# EAGLE board milliLearn-ice40-pcbng (EAGLE 9.5.1)
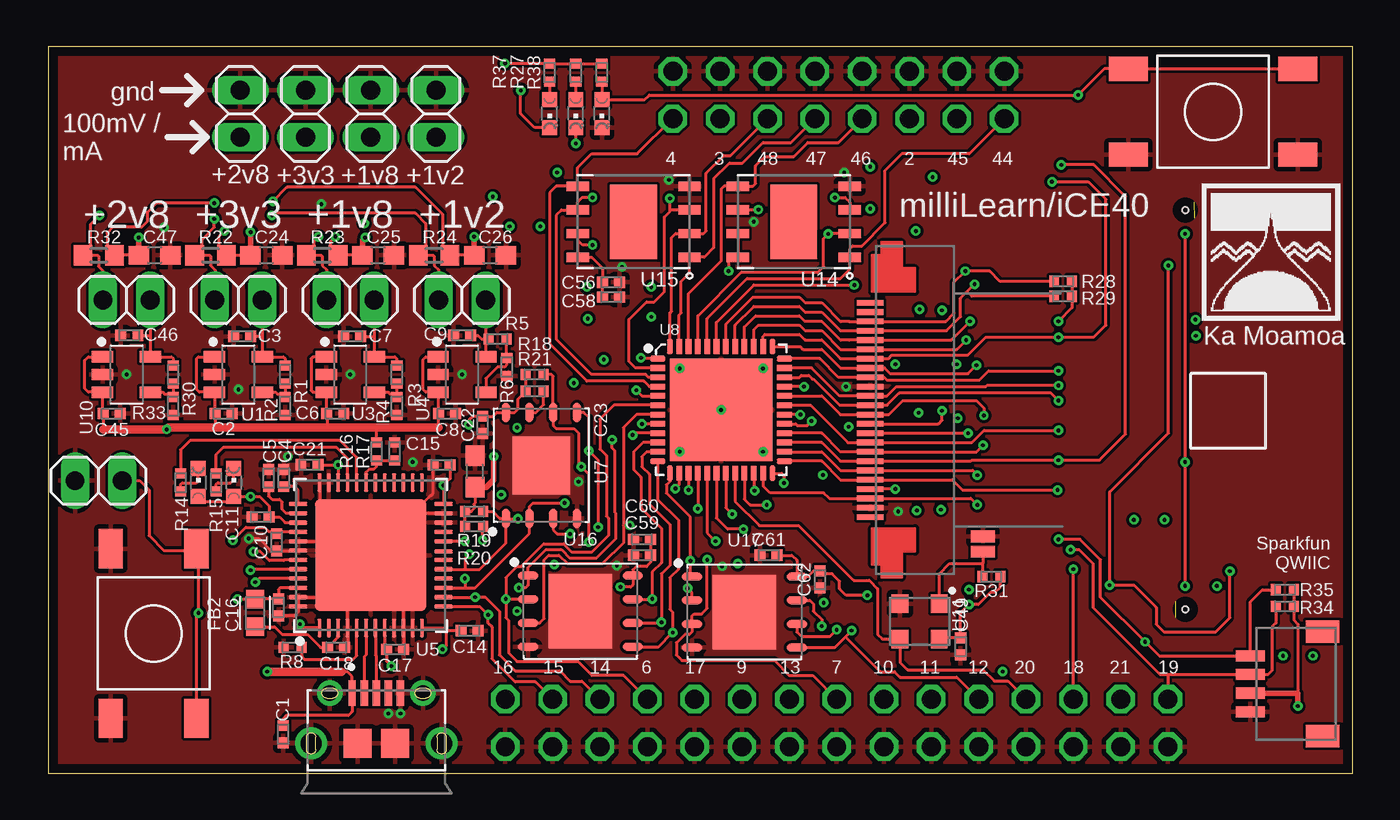
[diagram p4: board, top side]
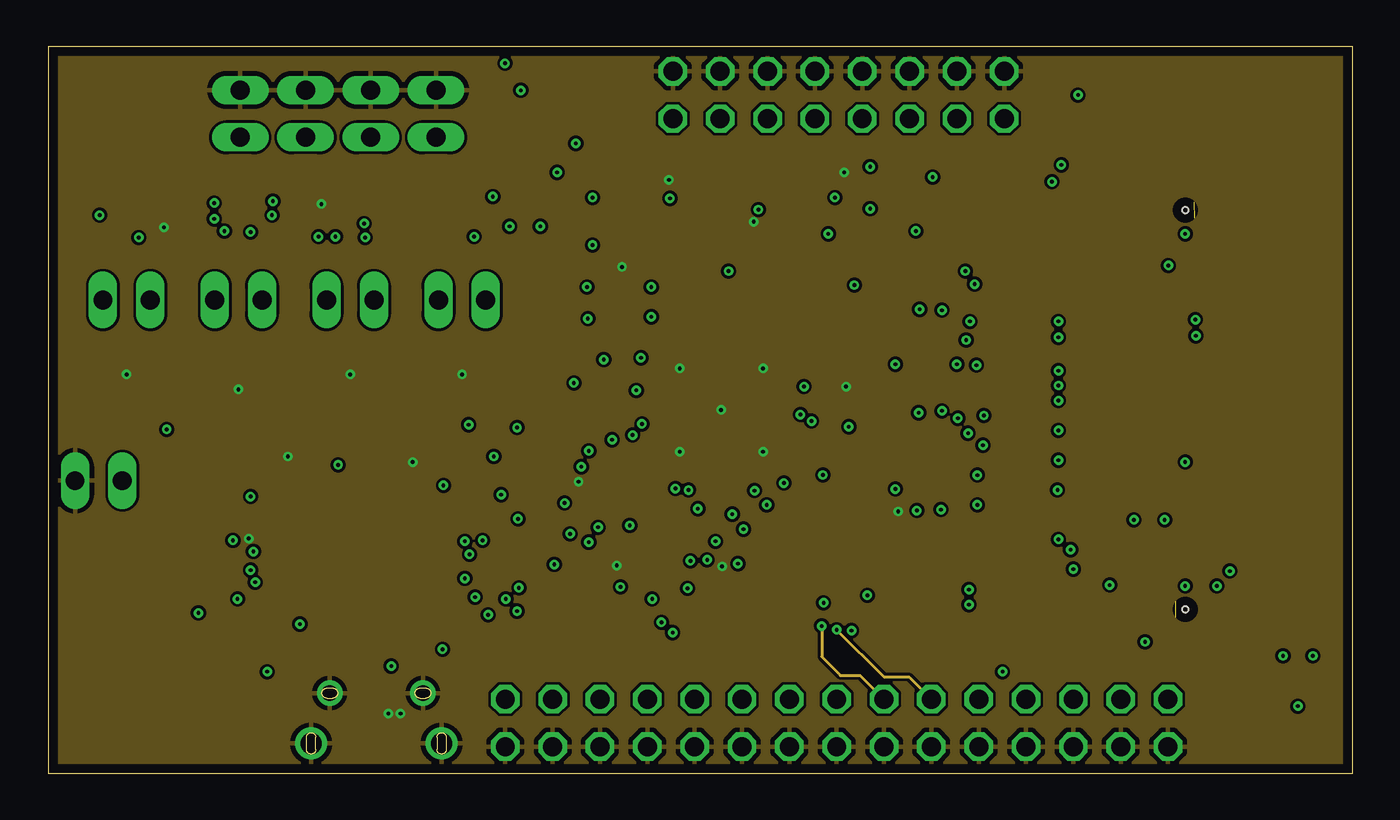
[diagram p5: board, inner layer Route2]
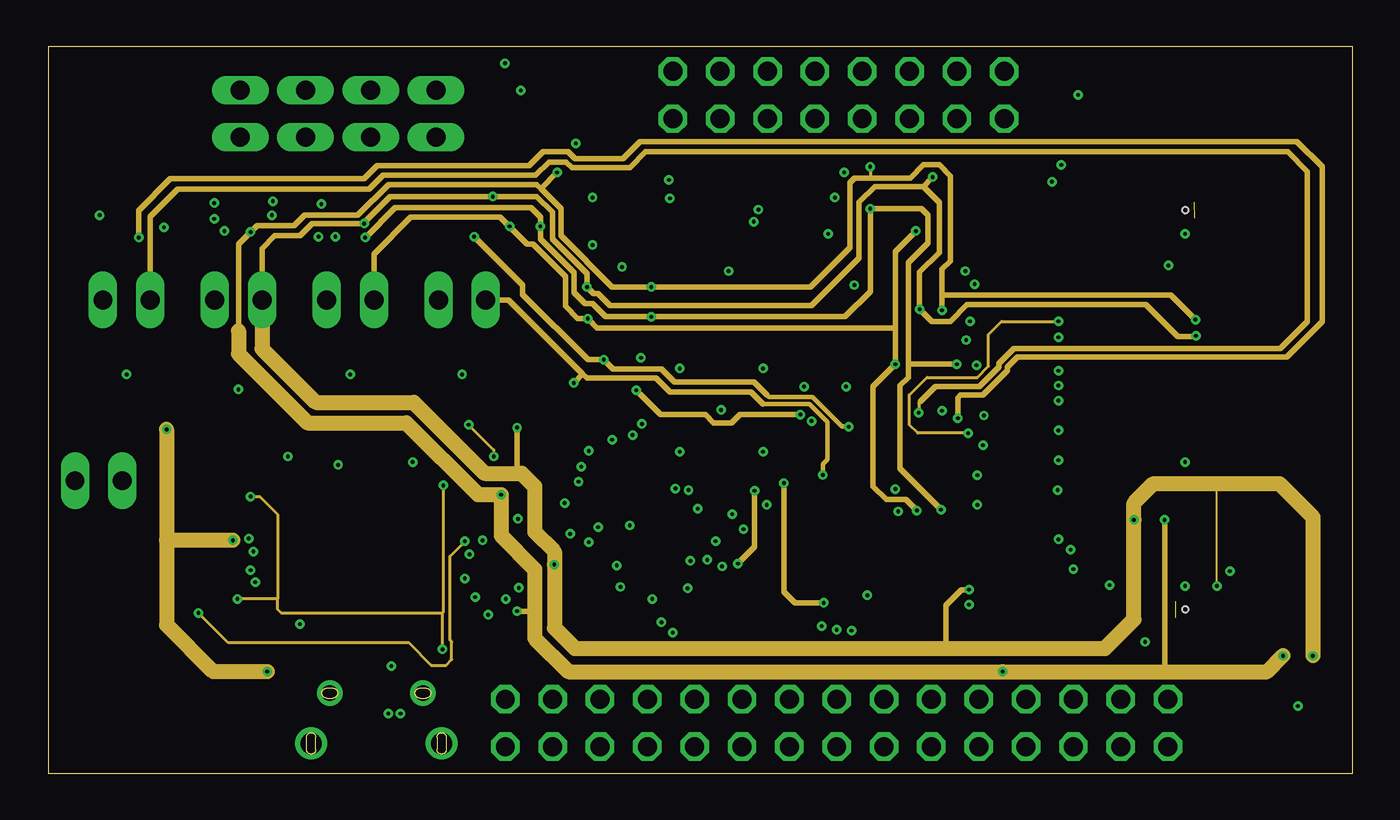
[diagram p6: board, inner layer Route15]
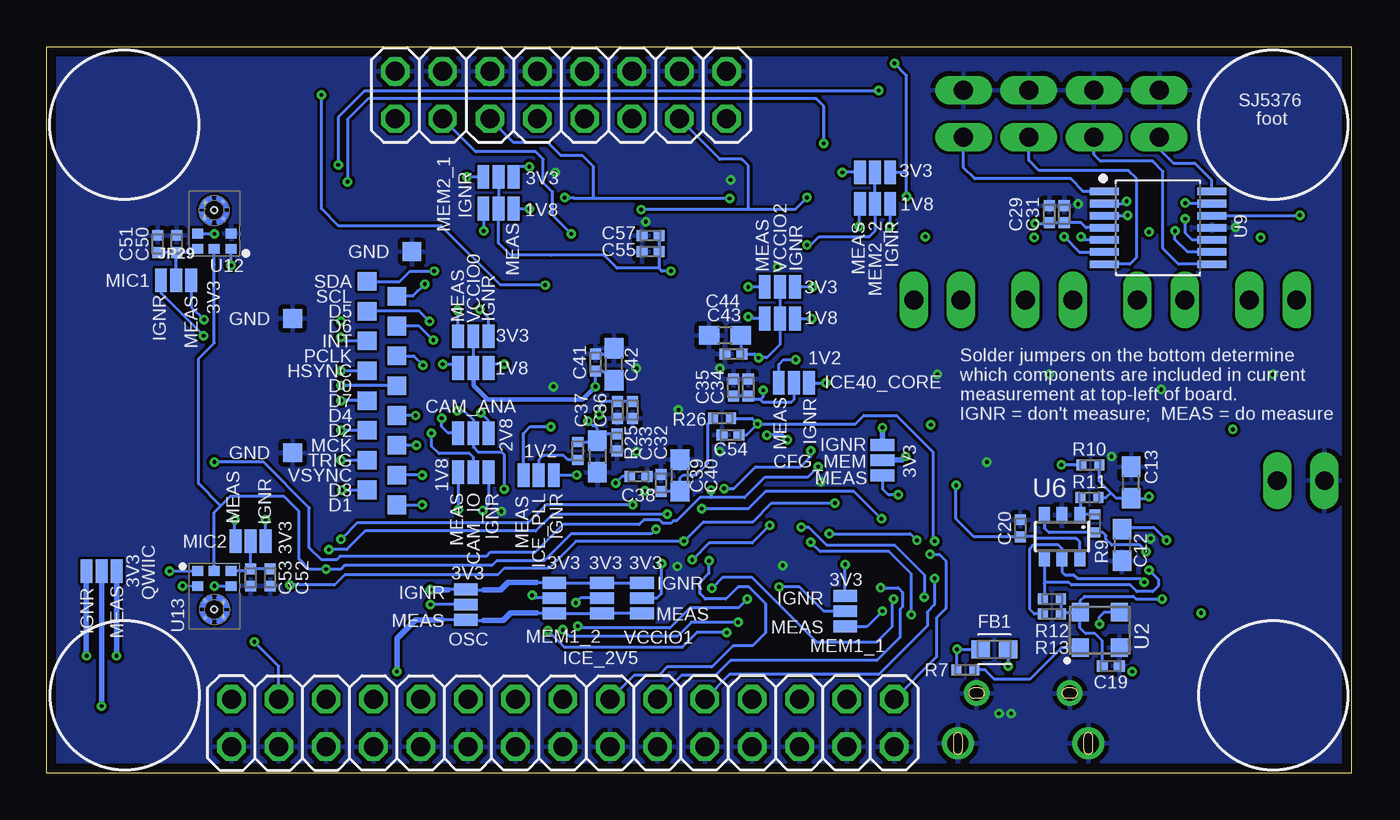
[diagram p7: board, bottom side, seen from below]

Size 70 x 39 mm. Coordinates in mm from the lower left corner, seen from the top.
Outline: 0,0 70,0 70,39 0,39 0,0
Copper layers (1+2*15+16): Top 1.5mil / dielectric 13mil / Route2 0.01778125mm / dielectric 28mil / Route15 0.01778125mm / dielectric 13mil / Bottom 1.5mil
Design rules "pcbng-4layer-conservative *": minimum track width 4mil, minimum drill 8mil, track to track 6mil, track to pad 6mil, pad to pad 6mil, via to via 6mil, smd to smd 6mil, copper to edge 20mil, drill to drill 6mil, minimum pad ring 10mil, minimum via ring 6mil, stop-mask expansion 4mil, vias tented up to drill 10mil, thermal gap 10mil

## Footprints (pad centres in the part's own frame; a part is rotated, then mirrored left to right if it is on the bottom)
C0402_COMPACT = smd 0.585 x 0.6: 1 -0.458,0; 2 0.458,0
C0603 = smd 1.1 x 1: 1 -0.85,0; 2 0.85,0
BLM18KG601SN1D = smd 1 x 0.97: 1 -0.735,0; 2 0.735,0
SFV24R-2STE1HLF = smd 0.3 x 1.4: P$1 -5.75,0; P$2 -5.25,0; P$3 -4.75,0; P$4 -4.25,0; P$5 -3.75,0; P$6 -3.25,0; P$7 -2.75,0; P$8 -2.25,0; P$9 -1.75,0; P$10 -1.25,0; P$11 -0.75,0; P$12 -0.25,0; P$13 0.25,0; P$14 0.75,0; P$15 1.25,0; P$16 1.75,0; P$17 2.25,0; P$18 2.75,0; P$19 3.25,0; P$20 3.75,0; P$21 4.25,0; P$22 4.75,0; P$23 5.25,0; P$24 5.75,0
AMPHENOL_10118194-0001LF = smd 0.4 x 1.35: 1 -1.3,2.7; 2 -0.65,2.7; 3 0,2.7; 4 0.65,2.7; 5 1.3,2.7 | drill 0.85: S1 -2.5,2.7; S2 2.5,2.7 | drill 1.15: S3 -3.5,0; S6 3.5,0 | smd 1.5 x 1.55: S4 -1,0; S5 1,0
SM04B-SRSS-TB(LF)(SN) = smd 1.2 x 1.8: NC@1 2.8,-3.875; NC@2 -2.8,-3.875 | smd 0.6 x 1.55: P$1 -1.5,0; P$2 -0.5,0; P$3 0.5,0; P$4 1.5,0
1X02 = drill 1.016 long: 1 -1.27,0; 2 1.27,0
SMT-JUMPER_3_1-NC_PASTE_NO-SILK = smd 0.635 x 1.27: 1 -0.813,0; 2 0,0; 3 0.813,0
SMT-JUMPER_3_NO_NO-SILK = smd 0.635 x 1.27: 1 -0.813,0; 2 0,0; 3 0.813,0
SMT-JUMPER_2_NO_NO-SILK = smd 0.635 x 1.27: 1 -0.406,0; 2 0.406,0
2X15 = drill 1.016 octagon: 1 -17.78,-1.27; 2 -17.78,1.27; 3 -15.24,-1.27; 4 -15.24,1.27; 5 -12.7,-1.27; 6 -12.7,1.27; 7 -10.16,-1.27; 8 -10.16,1.27; 9 -7.62,-1.27; 10 -7.62,1.27; 11 -5.08,-1.27; 12 -5.08,1.27; 13 -2.54,-1.27; 14 -2.54,1.27; 15 0,-1.27; 16 0,1.27; 17 2.54,-1.27; 18 2.54,1.27; 19 5.08,-1.27; 20 5.08,1.27; 21 7.62,-1.27; 22 7.62,1.27; 23 10.16,-1.27; 24 10.16,1.27; 25 12.7,-1.27; 26 12.7,1.27; 27 15.24,-1.27; 28 15.24,1.27; 29 17.78,-1.27; 30 17.78,1.27
2X08 = drill 1.016 octagon: 1 -8.89,-1.27; 2 -8.89,1.27; 3 -6.35,-1.27; 4 -6.35,1.27; 5 -3.81,-1.27; 6 -3.81,1.27; 7 -1.27,-1.27; 8 -1.27,1.27; 9 1.27,-1.27; 10 1.27,1.27; 11 3.81,-1.27; 12 3.81,1.27; 13 6.35,-1.27; 14 6.35,1.27; 15 8.89,-1.27; 16 8.89,1.27
CHIPLED_0603 = smd 0.8 x 0.8: A 0,-0.75; C 0,0.75
R0402_COMPACT = smd 0.535 x 0.6: 1 -0.482,0; 2 0.482,0
R0603 = smd 1 x 1.1: 1 -0.85,0; 2 0.85,0
TE_FSMJSMA = smd 1.3 x 2.1: P$1 -2.3,4.55; P$2 -2.3,-4.55; P$3 2.3,4.55; P$4 2.3,-4.55
TP10SQ = smd 1 x 1: TP 0,0
AP7366-W5-7 = smd 1.146 x 0.597: 1 -1.287,0.95; 2 -1.287,0; 3 -1.287,-0.95; 4 1.287,-0.95; 5 1.287,0.95
DSC6111CI2A-012.0000 = smd 1 x 0.9: P$1 -0.95,1.05; P$2 -0.95,-1.05; P$3 0.95,-1.05; P$4 0.95,1.05
MICROBUILDER_QFN48_8MM = smd 1 x 0.23: 1 -3.9,2.75; 2 -3.9,2.25; 3 -3.9,1.75; 4 -3.9,1.25; 5 -3.9,0.75; 6 -3.9,0.25; 7 -3.9,-0.25; 8 -3.9,-0.75; 9 -3.9,-1.25; 10 -3.9,-1.75; 11 -3.9,-2.25; 12 -3.9,-2.75; 25 3.9,-2.75; 26 3.9,-2.25; 27 3.9,-1.75; 28 3.9,-1.25; 29 3.9,-0.75; 30 3.9,-0.25; 31 3.9,0.25; 32 3.9,0.75; 33 3.9,1.25; 34 3.9,1.75; 35 3.9,2.25; 36 3.9,2.75 | smd 0.23 x 1: 13 -2.75,-3.9; 14 -2.25,-3.9; 15 -1.75,-3.9; 16 -1.25,-3.9; 17 -0.75,-3.9; 18 -0.25,-3.9; 19 0.2,-3.9; 20 0.75,-3.9; 21 1.25,-3.9; 22 1.75,-3.9; 23 2.25,-3.9; 24 2.75,-3.9; 37 2.75,3.9; 38 2.25,3.9; 39 1.75,3.9; 40 1.25,3.9; 41 0.75,3.9; 42 0.25,3.9; 43 -0.25,3.9; 44 -0.75,3.9; 45 -1.25,3.9; 46 -1.75,3.9; 47 -2.25,3.9; 48 -2.75,3.9 | smd 6 x 6: THERMAL 0,0
MICROCHIP_SOT23-6 = smd 0.6 x 0.9: 1 -0.95,-1.15; 2 0,-1.15; 3 0.95,-1.15; 4 0.95,1.15; 5 0,1.15; 6 -0.95,1.15
MT25QL128ABA1EW7 = smd 1.038 x 0.42: 1 -2.846,1.905; 2 -2.846,0.635; 3 -2.846,-0.635; 4 -2.846,-1.905; 5 2.846,-1.905; 6 2.846,-0.635; 7 2.846,0.635; 8 2.846,1.905 | smd 3.1 x 3.1: 9 0,0
ICE40UP5K/3K-SG48 = smd 0.8 x 0.3: 1 -3.4,2.75; 2 -3.4,2.25; 3 -3.4,1.75; 4 -3.4,1.25; 5 -3.4,0.75; 6 -3.4,0.25; 7 -3.4,-0.25; 8 -3.4,-0.75; 9 -3.4,-1.25; 10 -3.4,-1.75; 11 -3.4,-2.25; 12 -3.4,-2.75; 25 3.4,-2.75; 26 3.4,-2.25; 27 3.4,-1.75; 28 3.4,-1.25; 29 3.4,-0.75; 30 3.4,-0.25; 31 3.4,0.25; 32 3.4,0.75; 33 3.4,1.25; 34 3.4,1.75; 35 3.4,2.25; 36 3.4,2.75 | smd 0.3 x 0.8: 13 -2.75,-3.4; 14 -2.25,-3.4; 15 -1.75,-3.4; 16 -1.25,-3.4; 17 -0.75,-3.4; 18 -0.25,-3.4; 19 0.25,-3.4; 20 0.75,-3.4; 21 1.25,-3.4; 22 1.75,-3.4; 23 2.25,-3.4; 24 2.75,-3.4; 37 2.75,3.4; 38 2.25,3.4; 39 1.75,3.4; 40 1.25,3.4; 41 0.75,3.4; 42 0.25,3.4; 43 -0.25,3.4; 44 -0.75,3.4; 45 -1.25,3.4; 46 -1.75,3.4; 47 -2.25,3.4; 48 -2.75,3.4 | smd 5.5 x 5.5: 49 0,0
INA4180A4IPWR = smd 1.559 x 0.407: 1 -2.878,1.95; 2 -2.878,1.3; 3 -2.878,0.65; 4 -2.878,0; 5 -2.878,-0.65; 6 -2.878,-1.3; 7 -2.878,-1.95; 8 2.878,-1.95; 9 2.878,-1.3; 10 2.878,-0.65; 11 2.878,0; 12 2.878,0.65; 13 2.878,1.3; 14 2.878,1.95
SPH0645LM4H-B = smd 0.6 x 0.522: P$1 -0.9,1.359; P$2 -0.9,0.537; P$4 0.9,0.537; P$5 0.9,1.359; P$6 0,1.359 | smd 0.25 x 0.25: P$3@0 -0.48,-0.26; P$3@1 0.51,-0.28; P$3@2 -0.48,-1.17; P$3@3 0.5,-1.14 | hole 0.325: 0,-0.715
CY15B104Q-LHXI = smd 0.5 x 1.2: P$1 -1.905,-3; P$2 -0.635,-3; P$3 0.635,-3; P$4 1.905,-3; P$5 1.905,3; P$6 0.635,3; P$7 -0.635,3; P$8 -1.905,3 | smd 4 x 2.5: P$9 0,0
AT25QF641B-SHB-T = smd 1.099 x 0.442: 1 -2.815,1.905; 2 -2.815,0.635; 3 -2.815,-0.635; 4 -2.815,-1.905; 5 2.815,-1.905; 6 2.815,-0.635; 7 2.815,0.635; 8 2.815,1.905 | smd 3.4 x 4: 9 0,0

## Placement (x,y rotation side)
C1  1u  [C0402_COMPACT]  12.6,2.1 90 top
C2  1u  [C0402_COMPACT]  9.4,19.3 180 top
C3  1u  [C0402_COMPACT]  10.4,23.45 0 top
C4  100n  [C0402_COMPACT]  12.63,15.84 270 top
C5  100n  [C0402_COMPACT]  11.82,15.84 270 top
C6  1u  [C0402_COMPACT]  15.4,19.3 180 top
C7  1u  [C0402_COMPACT]  16.3,23.45 0 top
C8  1u  [C0402_COMPACT]  21.4,19.3 180 top
C9  1u  [C0402_COMPACT]  22.2,23.5 0 top
C10  100n  [C0402_COMPACT]  12.25,12.4 90 top
C11  100n  [C0402_COMPACT]  11.4,13.75 0 top
C12  4.7u  [C0603]  12.3,12.25 270 bottom
C13  4.7u  [C0603]  11.8,15.6 90 bottom
C14  100n  [C0402_COMPACT]  22.6,7.65 180 top
C15  100n  [C0402_COMPACT]  21.1,16.55 0 top
C16  100n  [C0402_COMPACT]  12.35,8.9 90 top
C17  100n  [C0402_COMPACT]  18.6,6.65 180 top
C18  100n  [C0402_COMPACT]  15.45,6.75 180 top
C19  100n  [C0402_COMPACT]  12.9,5.75 180 bottom
C20  100n  [C0402_COMPACT]  17.75,13.15 270 bottom
C21  10n  [C0402_COMPACT]  14.01,16.56 0 top
C22  100n  [C0402_COMPACT]  23.3,18.7 90 top
C23  4.7u  [C0603]  22.9,16.2 90 top
C24  4.7u  [C0603]  11.7,27.8 0 top
C25  4.7u  [C0603]  17.7,27.8 0 top
C26  4.7u  [C0603]  23.7,27.8 0 top
C29  1u  [C0402_COMPACT]  16.2,30 270 bottom
C31  100n  [C0402_COMPACT]  15.4,30 270 bottom
C32  100n  [C0402_COMPACT]  39.4,17.75 90 bottom
C33  4.7u  [C0603]  40.45,17 270 bottom
C34  1u  [C0402_COMPACT]  32.35,20.7 270 bottom
C35  100n  [C0402_COMPACT]  33.15,20.7 270 bottom
C36  1u  [C0402_COMPACT]  38.56,19.49 90 bottom
C37  100n  [C0402_COMPACT]  39.37,19.49 90 bottom
C38  100n  [C0402_COMPACT]  38.25,15.93 180 bottom
C39  100n  [C0402_COMPACT]  37.03,15.58 270 bottom
C40  4.7u  [C0603]  36.02,15.98 90 bottom
C41  100n  [C0402_COMPACT]  40.55,22.05 270 bottom
C42  4.7u  [C0603]  39.55,21.95 90 bottom
C43  100n  [C0402_COMPACT]  33.15,22.5 0 bottom
C44  4.7u  [C0603]  33.6,23.5 180 bottom
C45  1u  [C0402_COMPACT]  3.4,19.3 180 top
C46  1u  [C0402_COMPACT]  4.35,23.5 0 top
C47  4.7u  [C0603]  5.7,27.8 0 top
C49  100n  [C0402_COMPACT]  48.95,6.8 90 top
C50  100n  [C0402_COMPACT]  63.02,28.41 270 bottom
C51  220p  [C0402_COMPACT]  64.04,28.41 270 bottom
C52  100n  [C0402_COMPACT]  58,10.5 90 bottom
C53  220p  [C0402_COMPACT]  59.05,10.5 90 bottom
C54  100n  [C0402_COMPACT]  33.3,18.15 0 bottom
C55  100n  [C0402_COMPACT]  37.6,28 0 bottom
C56  100n  [C0402_COMPACT]  30.2,26.35 180 top
C57  1u  [C0402_COMPACT]  37.6,28.85 0 bottom
C58  1u  [C0402_COMPACT]  30.2,25.55 180 top
C59  100n  [C0402_COMPACT]  31.85,11.7 0 top
C60  1u  [C0402_COMPACT]  31.85,12.55 0 top
C61  100n  [C0402_COMPACT]  38.65,11.7 0 top
C62  1u  [C0402_COMPACT]  41.4,10.4 90 top
FB1  BLM18KG601SN1D  [BLM18KG601SN1D]  19.15,6.65 0 bottom
FB2  BLM18KG601SN1D  [BLM18KG601SN1D]  11.1,8.6 270 top
J1  SFV24R-2STE1HLF  [SFV24R-2STE1HLF]  44.1,19.5 90 top
J2  10118194-0001LF  [AMPHENOL_10118194-0001LF]  17.6,1.6 0 top
J3  SM04B-SRSS-TB(LF)(SN)  [SM04B-SRSS-TB(LF)(SN)]  64.5,4.8 90 top
JP1  [1X02]  10.2,25.4 180 top
JP2  [1X02]  16.2,25.4 180 top
JP3  [1X02]  22.2,25.4 180 top
JP4  JUMPER-SMT_3_1-NC_PASTE_NO-SILK  [SMT-JUMPER_3_1-NC_PASTE_NO-SILK]  25.15,16.8 270 bottom
JP5  JUMPER-SMT_3_1-NC_PASTE_NO-SILK  [SMT-JUMPER_3_1-NC_PASTE_NO-SILK]  29.9,20.95 180 bottom
JP6  JUMPER-SMT_3_1-NC_PASTE_NO-SILK  [SMT-JUMPER_3_1-NC_PASTE_NO-SILK]  43.6,16 180 bottom
JP7  JUMPER-SMT_3_1-NC_PASTE_NO-SILK  [SMT-JUMPER_3_1-NC_PASTE_NO-SILK]  40.2,9.4 90 bottom
JP8  JUMPER-SMT_3_1-NC_PASTE_NO-SILK  [SMT-JUMPER_3_1-NC_PASTE_NO-SILK]  38.05,9.4 270 bottom
JP9  JUMPER-SMT_3_NO_NO-SILK  [SMT-JUMPER_3_NO_NO-SILK]  47.1,23.45 0 bottom
JP10  [1X02]  20.8,35.4 90 top
JP11  [1X02]  17.3,35.4 90 top
JP12  [1X02]  13.8,35.4 90 top
JP13  JUMPER-SMT_3_1-NC_PASTE_NO-SILK  [SMT-JUMPER_3_1-NC_PASTE_NO-SILK]  47.1,21.75 180 bottom
JP14  JUMPER-SMT_3_1-NC_PASTE_NO-SILK  [SMT-JUMPER_3_1-NC_PASTE_NO-SILK]  30.65,26.1 180 bottom
JP15  [1X02]  10.3,35.4 90 top
JP16  JUMPER-SMT_3_1-NC_PASTE_NO-SILK  [SMT-JUMPER_3_1-NC_PASTE_NO-SILK]  47.1,16.15 0 bottom
JP17  JUMPER-SMT_3_1-NC_PASTE_NO-SILK  [SMT-JUMPER_3_1-NC_PASTE_NO-SILK]  47.1,18.25 0 bottom
JP18  [1X02]  4.2,25.4 180 top
JP19  JUMPER-SMT_3_1-NC_PASTE_NO-SILK  [SMT-JUMPER_3_1-NC_PASTE_NO-SILK]  47.5,9.05 90 bottom
JP20  JUMPER-SMT_3_NO_NO-SILK  [SMT-JUMPER_3_NO_NO-SILK]  30.65,24.4 0 bottom
JP21  JUMPER-SMT_2_NO_NO-SILK  [SMT-JUMPER_2_NO_NO-SILK]  50.15,12.3 90 top
JP22  JUMPER-SMT_3_1-NC_PASTE_NO-SILK  [SMT-JUMPER_3_1-NC_PASTE_NO-SILK]  67.05,10.85 180 bottom
JP23  JUMPER-SMT_3_1-NC_PASTE_NO-SILK  [SMT-JUMPER_3_1-NC_PASTE_NO-SILK]  27.15,8.7 90 bottom
JP24  JUMPER-SMT_3_1-NC_PASTE_NO-SILK  [SMT-JUMPER_3_1-NC_PASTE_NO-SILK]  42.75,9.4 90 bottom
JP25  JUMPER-SMT_3_1-NC_PASTE_NO-SILK  [SMT-JUMPER_3_1-NC_PASTE_NO-SILK]  45.75,32 180 bottom
JP26  JUMPER-SMT_3_NO_NO-SILK  [SMT-JUMPER_3_NO_NO-SILK]  45.75,30.3 180 bottom
JP27  JUMPER-SMT_3_1-NC_PASTE_NO-SILK  [SMT-JUMPER_3_1-NC_PASTE_NO-SILK]  25.55,32.25 0 bottom
JP28  JUMPER-SMT_3_NO_NO-SILK  [SMT-JUMPER_3_NO_NO-SILK]  25.55,30.55 0 bottom
JP29  JUMPER-SMT_3_1-NC_PASTE_NO-SILK  [SMT-JUMPER_3_1-NC_PASTE_NO-SILK]  63.05,26.45 0 bottom
JP30  JUMPER-SMT_3_1-NC_PASTE_NO-SILK  [SMT-JUMPER_3_1-NC_PASTE_NO-SILK]  59.05,12.45 0 bottom
JP31  [1X02]  2.7,15.7 180 top
JP40  [2X15]  42.3,2.7 180 bottom
JP41  [2X08]  42.4,36.4 0 bottom
LED1  [CHIPLED_0603]  8.05,15.6 0 top
LED2  [CHIPLED_0603]  9.95,15.6 0 top
LED3  [CHIPLED_0603]  28.3,35.4 180 top
LED4  [CHIPLED_0603]  26.9,35.4 180 top
LED5  [CHIPLED_0603]  29.7,35.4 180 top
R1  75k 1%  [R0402_COMPACT]  12.7,21.4 270 top
R2  24k 1%  [R0402_COMPACT]  12.7,19.7 270 top
R3  20k 1%  [R0402_COMPACT]  18.7,21.4 270 top
R4  16k 1%  [R0402_COMPACT]  18.7,19.7 270 top
R5  12k 1%  [R0402_COMPACT]  24.1,23.3 0 top
R6  24k 1%  [R0402_COMPACT]  24.6,21.8 270 top
R7  10k  [R0402_COMPACT]  20.7,5.55 0 bottom
R8  12k 1%  [R0402_COMPACT]  13.1,6.75 0 top
R9  2.2k  [R0402_COMPACT]  13.75,13.4 270 bottom
R10  10k  [R0402_COMPACT]  14,16.55 180 bottom
R11  10k  [R0402_COMPACT]  14.05,14.8 180 bottom
R12  DNP  [R0402_COMPACT]  16.05,9.35 180 bottom
R13  DNP  [R0402_COMPACT]  16.05,8.55 180 bottom
R14  1k  [R0402_COMPACT]  7.1,15.6 270 top
R15  1k  [R0402_COMPACT]  9,15.6 270 top
R16  4.7k  [R0402_COMPACT]  17.61,17.26 270 top
R17  12k  [R0402_COMPACT]  18.57,17.26 90 top
R18  10k  [R0402_COMPACT]  26.1,21.4 0 top
R19  10k  [R0402_COMPACT]  22.85,14.05 0 top
R20  10k  [R0402_COMPACT]  22.85,13.25 0 top
R21  10k  [R0402_COMPACT]  26.1,20.5 0 top
R22  0.5 1%  [R0603]  8.7,27.8 0 top
R23  0.5 1%  [R0603]  14.7,27.8 0 top
R24  0.5 1%  [R0603]  20.7,27.8 0 top
R25  100  [R0402_COMPACT]  41.5,17.3 90 bottom
R26  10k  [R0402_COMPACT]  33.75,19.05 0 bottom
R27  1k  [R0402_COMPACT]  28.3,37.6 270 top
R28  10k  [R0402_COMPACT]  54.45,26.4 180 top
R29  10k  [R0402_COMPACT]  54.45,25.6 180 top
R30  30k 1%  [R0402_COMPACT]  6.7,21.4 270 top
R31  10k  [R0402_COMPACT]  50.6,10.55 180 top
R32  0.5 1%  [R0603]  2.7,27.8 0 top
R33  12k 1%  [R0402_COMPACT]  6.7,19.7 270 top
R34  4.7k  [R0402_COMPACT]  66.35,8.95 180 top
R35  4.7k  [R0402_COMPACT]  66.35,9.85 180 top
R37  1k  [R0402_COMPACT]  26.9,37.6 270 top
R38  1k  [R0402_COMPACT]  29.7,37.6 270 top
SW1  [TE_FSMJSMA]  5.65,7.5 180 top
SW2  [TE_FSMJSMA]  62.5,35.5 270 top
TP0  TPTP10SQ  [TP10SQ]  50.4,28 0 bottom
TP1  TPTP10SQ  [TP10SQ]  51.2,14.4 0 bottom
TP2  TPTP10SQ  [TP10SQ]  52.8,15.2 0 bottom
TP3  TPTP10SQ  [TP10SQ]  51.2,16 0 bottom
TP4  TPTP10SQ  [TP10SQ]  52.8,16.8 0 bottom
TP5  TPTP10SQ  [TP10SQ]  51.2,17.6 0 bottom
TP6  TPTP10SQ  [TP10SQ]  52.8,18.4 0 bottom
TP7  TPTP10SQ  [TP10SQ]  51.2,19.2 0 bottom
TP8  TPTP10SQ  [TP10SQ]  52.8,20 0 bottom
TP9  TPTP10SQ  [TP10SQ]  51.2,20.8 0 bottom
TP10  TPTP10SQ  [TP10SQ]  52.8,21.6 0 bottom
TP11  TPTP10SQ  [TP10SQ]  51.2,22.4 0 bottom
TP12  TPTP10SQ  [TP10SQ]  52.8,23.2 0 bottom
TP13  TPTP10SQ  [TP10SQ]  51.2,24 0 bottom
TP14  TPTP10SQ  [TP10SQ]  52.8,24.8 0 bottom
TP15  TPTP10SQ  [TP10SQ]  51.2,25.6 0 bottom
TP16  TPTP10SQ  [TP10SQ]  52.8,26.4 0 bottom
TP17  TPTP10SQ  [TP10SQ]  56.8,24.4 0 bottom
TP18  TPTP10SQ  [TP10SQ]  56.8,17.2 0 bottom
U1  AP7366-W5-7  [AP7366-W5-7]  10.2,21.4 0 top
U2  DSC6111CI2A-012.0000  [DSC6111CI2A-012.0000]  13.48,7.69 90 bottom
U3  AP7366-W5-7  [AP7366-W5-7]  16.2,21.4 0 top
U4  AP7366-W5-7  [AP7366-W5-7]  22.2,21.4 0 top
U5  MICROBUILDER_FT232HQ  [MICROBUILDER_QFN48_8MM]  17.3,11.7 90 top
U6  MICROCHIP_93LC76B  [MICROCHIP_SOT23-6]  15.51,12.7 180 bottom
U7  MT25QL128ABA1EW7  [MT25QL128ABA1EW7]  26.46,16.53 90 top
U8  ICE40UP5K/3K-SG48  [ICE40UP5K/3K-SG48]  36.1,19.5 0 top
U9  INA4180A4IPWR  [INA4180A4IPWR]  10.36,29.27 0 bottom
U10  AP7366-W5-7  [AP7366-W5-7]  4.2,21.4 0 top
U11  DSC6111CI2A-012.0000  [DSC6111CI2A-012.0000]  46.75,8.15 270 top
U12  SPH0645LM4H-B  [SPH0645LM4H-B]  61,29.5 180 bottom
U13  SPH0645LM4H-B  [SPH0645LM4H-B]  61,9.5 0 bottom
U14  CY15B104Q-LHXI  [CY15B104Q-LHXI]  40,29.6 90 top
U15  CY15B104Q-LHXI  [CY15B104Q-LHXI]  31.4,29.6 90 top
U16  AT25QF641B-SHB-T  [AT25QF641B-SHB-T]  28.55,8.7 0 top
U17  AT25QF641B-SHB-T  [AT25QF641B-SHB-T]  37.35,8.65 0 top

## Tracks (layer width: path | path; a pad name or v marks a point on that pad's centre or on a via)
+1V2  (via drill 0.2)
  Top 0.152: JP3.1 23.47,23.45 23.49,23.43 | 23.49,23.43 R5.1 | U4.5 23.49,23.3 | 23.49,23.3 23.49,23.43 | C9.2 23.05,23.5 23.25,23.3 23.49,23.3
  Route15 0.229: 38.34,19.81 40.84,19.81 41.8,18.85 41.8,16.85 41.56,16.61 v41.56,16.01
  Route15 0.305: JP3.1 24.7,25.4 28.68,21.43 | 38.34,19.81 37.7,20.45 33.35,20.45 32.6,21.2 28.9,21.2 28.68,21.43 | v28.2,20.95 28.68,21.43
  Bottom 0.152: JP5.1 v28.2,20.95 | JP6.1 v41.57,16 v41.56,16.01
+1V2_METERED  (via drill 0.2)
  Top 0.152: C26.1 R24.2 21.5,27.8 21.15,28.15 21.15,30 19.7,31.45 12.8,31.45 v12.05,30.7
  Top 0.305: C26.1 v22.85,28.8
  Route15 0.229: 38.55,20.3 38.66,20.19 41,20.19 42.59,18.6 v42.95,18.6
  Route15 0.305: v22.85,28.8 25.45,26.2 25.45,25.7 28.95,22.2 v29.8,22.2 30.3,21.7 32.9,21.7 33.6,21 37.85,21 38.55,20.3
  Bottom 0.152: U9.2 12.18,30.57 v12.05,30.7 | JP5.3 30.71,21.94 30.45,22.2 v29.8,22.2 | JP6.3 44.41,17.2 44.41,18.24 44.05,18.6 v42.95,18.6
+1V8  (via drill 0.2)
  Top 0.152: R3.1 18.7,22.25 18.6,22.35 U3.5 17.47,22.37 17.47,23.45 | JP2.1 17.47,23.45 | C7.2 17.47,23.45
  Route15 0.305: JP2.1 17.47,27.87 19.45,29.85 24.25,29.85 v24.75,29.35 25.7,28.4 26.01,28.4 27.74,26.67 27.74,25.06 28.4,24.4 v28.95,24.4 29.45,23.9 45.45,23.9 | v46.55,29.1 45.45,28 45.45,23.9 | 45.45,23.9 v45.45,21.95 44.25,20.75 44.25,15.4 44.96,14.69 46.01,14.69 v46.6,14.1
  Bottom 0.152: JP28.3 24.75,30.54 v24.75,29.35 | 29.85,24.39 JP20.3 v28.95,24.4 | JP16.3 46.29,14.41 v46.6,14.1 | JP26.3 46.56,29.11 v46.55,29.1 | v45.45,21.95 46.09,21.95 JP13.1
+1V8_METERED  (via drill 0.2)
  Top 0.152: v15.4,28.8 15.15,28.55 15.15,28.2 R23.2 C25.1
  Top 0.305: C25.1 16.85,28.6 v17,28.75
  Route15 0.305: v17,28.75 17.01,28.75 18.61,30.35 25.9,30.35 26.4,29.85 v26.4,29.35 26.4,28.66 28.2,26.86 28.2,25.8 28.8,25.2 29.2,25.2 29.9,24.5 v32.35,24.5 42.74,24.5 44.1,25.86 v44.1,30.3 46.85,30.3 47.2,29.95 47.2,28.45 46.15,27.4 46.15,21.95 | v48.75,21.95 46.15,21.95 | v47.9,14.15 45.7,16.35 45.7,20.8 46.15,21.25 46.15,21.95
  Bottom 0.152: v15.4,28.8 14.57,27.97 U9.6 | JP28.1 26.4,30.51 v26.4,29.35 | JP20.1 32.25,24.4 v32.35,24.5 | JP26.1 v44.1,30.3 | v48.75,21.95 48.11,21.95 | JP16.1 47.91,14.16 v47.9,14.15
  Bottom 0.305: JP13.3 48.11,21.95
+2V8  (via drill 0.2)
  Top 0.152: R30.1 6.7,22.25 6.6,22.35 U10.5 5.47,22.37 5.47,23.5 | JP18.1 5.47,23.5 | C46.2 5.47,23.5
  Route15 0.152: 46.8,19.95 46.7,19.85 v46.7,19.35
  Route15 0.305: JP18.1 5.47,29.87 6.95,31.35 17.2,31.35 17.95,32.1 26.15,32.1 26.86,32.81 27.79,32.81 28.1,32.5 31.2,32.5 32.05,33.35 66.5,33.35 67.55,32.3 67.55,24.25 66.1,22.8 51.8,22.8 51,22 51,21.8 49.95,20.75 47.6,20.75 46.8,19.95
  Bottom 0.152: JP17.3 46.29,18.94 v46.7,19.35
+2V8_METERED  (via drill 0.2)
  Top 0.152: C47.1 R32.2 3.15,27.8 3.15,29 3.45,29.3 5,29.3 5.3,29.6 5.3,30.1 5.8,30.6 v8.9,30.6
  Top 0.305: C47.1 v4.85,28.75
  Route15 0.305: v4.85,28.75 4.85,30.2 6.55,31.9 16.95,31.9 17.65,32.6 25.8,32.6 26.55,33.35 27.9,33.35 28.27,32.97 30.82,32.97 31.75,33.9 67,33.9 68.35,32.55 68.35,24.25 66.44,22.34 51.99,22.34 51.46,21.81 51.46,21.61 50.14,20.29 48.95,20.29 48.8,20.14 v48.8,19.05
  Bottom 0.152: U9.13 8.87,30.57 v8.9,30.6 | JP17.1 48.45,18.25 48.8,18.6 v48.8,19.05
+3V3  (via drill 0.2)
  Top 0.152: R1.1 12.7,22.25 12.6,22.35 U1.5 11.5,22.36 11.5,22.4 11.47,22.43 11.47,23.4 | JP1.1 11.47,23.4 | 11.47,23.4 11.42,23.45 C3.2 | v24.5,38.1 26.88,38.1 R37.1 R27.1 R38.1
  Route15 0.102: v62.7,10.05 62.7,15.55
  Route15 0.305: 11.42,25.45 JP1.1 11.47,28.17 12.15,28.85 13.5,28.85 14.15,29.5 v16.95,29.5 16.95,29.55 18.35,30.95 v23.85,30.95 26.2,30.95 27.04,30.11 27.04,28.66 28.9,26.8 v28.9,26.1 29.25,25.75 29.5,25.75 30.15,25.1 40.95,25.1 43.5,27.65 43.5,30.65 44.34,31.49 46.94,31.49 | v25.15,18.55 25.15,16.35 25.4,16.1 | 46.94,31.49 v47.45,32 | 46.94,31.49 47.8,30.64 47.8,27.95 46.75,26.9 v46.75,24.9 47.4,24.25 48.4,24.25 49.3,25.15 58.89,25.15 60.62,23.42 61.52,23.42 v61.58,23.48 | v49.4,9.85 49,9.85 48.15,9 48.15,6.7
  Route15 0.813: JP1.1 11.47,22.78 14.35,19.9 19.6,19.9 23.4,16.1 25.4,16.1 26.1,15.4 26.1,12.95 27.15,11.9 v27.15,11.2 27.15,7.8 28.25,6.7 48.15,6.7 56.7,6.7 58.25,8.25 v58.25,13.6 58.25,14.5 59.3,15.55 62.7,15.55 66.05,15.55 67.85,13.75 v67.85,6.3
  Bottom 0.102: U13.P$2 62.69,10.04 v62.7,10.05
  Bottom 0.152: v28.9,26.1 JP14.1 | JP23.3 v27.15,11.2 | v16.95,29.5 16.24,29.5 C29.2 C31.2 14.49,29.54 14.22,29.27 U9.4 | JP25.3 v47.45,32 | JP9.3 46.29,24.44 v46.75,24.9 | JP29.1 63.86,25.77 v61.58,23.48 | JP30.3 58.24,13.59 v58.25,13.6 | v23.85,30.95 23.85,32.25 | 23.85,32.25 23.85,37.45 v24.5,38.1 | JP8.1 JP7.3 JP24.3 42.79,10.25 43.7,10.25 | 46.55,9.85 47.49,9.85 JP19.3 48.44,9.86 48.45,9.85 | JP27.3 23.85,32.25
  Bottom 0.305: JP4.1 v25.15,18.55 | JP22.3 67.86,6.31 v67.85,6.3 | 48.45,9.85 v49.4,9.85 | 46.55,9.85 45.65,9.85 45.25,10.25 43.7,10.25
+3V3_METERED  (via drill 0.2)
  Top 0.152: v9.45,29.1 9.15,28.8 9.15,28.2 R22.2 C24.1
  Top 0.305: C24.1 v10.85,29.05
  Route15 0.152: v44.1,32.55 44.1,31.95
  Route15 0.305: 26.43,31.38 26.2,31.6 18.25,31.6 16.61,29.96 13.76,29.96 13.2,29.4 12.24,29.4 12.23,29.39 11.19,29.39 v10.85,29.05 10.2,28.4 10.2,23.75 | 26.43,31.38 27.5,30.3 27.5,28.85 30.25,26.1 v32.35,26.1 40.9,26.1 43,28.2 43,31.7 43.25,31.95 44.1,31.95 46.25,31.95 46.95,32.65 47.8,32.65 48.4,32.05 48.4,27.5 47.95,27.05 47.95,25.65 | v27.3,32.25 26.43,31.38 | 47.95,25.65 v47.95,24.85 | v61.55,24.34 60.24,25.65 47.95,25.65 | v59.9,13.6 59.9,5.45 | v25.15,8.7 26.1,8.7
  Route15 0.813: 10.2,23.75 10.2,22.5 13.9,18.8 19.2,18.8 23.05,14.95 v24.3,14.95 24.3,12.75 26.1,10.95 26.1,8.7 26.1,7.25 27.9,5.45 v51.2,5.45 59.9,5.45 65.4,5.45 v66.25,6.3
  Bottom 0.152: U9.9 8.77,27.97 9.45,28.65 v9.45,29.1 | JP14.3 v32.35,26.1 | JP27.1 v27.3,32.25 | JP25.1 44.95,32.01 44.95,32.5 44.9,32.55 v44.1,32.55 | v47.95,24.85 47.95,23.49 JP9.1 | JP29.3 62.24,25.03 v61.55,24.34 | JP30.1 59.9,12.49 v59.9,13.6 | 48.76,8.24 JP19.1 47.46,8.2 46.55,8.2 | 27.1,7.84 JP23.1 25.96,7.89 v25.15,8.7 | JP8.3 JP7.1 JP24.1 42.76,8.6 43.7,8.6 | JP4.3 25.15,15.25 24.85,14.95 v24.3,14.95
  Bottom 0.305: v66.25,6.3 66.24,6.31 JP22.1 | 48.76,8.24 50.21,8.24 51.2,7.25 v51.2,5.45 | 43.7,8.6 45.1,8.6 45.5,8.2 46.55,8.2
CONFIG_FLASH_+3V3  (via drill 0.2)
  Top 0.152: R18.1 R21.1 25.2,20.08 25.2,19.55 25.02,19.37 U7.8 24.07,19.37 23.86,19.16 C22.2 22.76,19.16 22.55,18.95 v22.55,18.7 | 22.85,15.35 C23.1 22.9,14.51 22.84,14.45 22.84,14.2 22.69,14.05 R19.1 R20.1
  Top 0.305: C23.1 23.5,15.35 23.9,15.75 v23.9,17
  Route15 0.152: v22.55,18.7 23.9,17.35 v23.9,17
  Bottom 0.305: JP4.2 24.1,16.8 v23.9,17
D+
  Top 0.152: U5.7 17.55,6.35 17.6,6.3 J2.3
D-
  Top 0.152: U5.6 17.05,6.35 16.95,6.25 J2.2
FT232_OSC_12M  (via drill 0.2)
  Top 0.152: U5.1 13.7,7.8 v13.5,8
  Bottom 0.152: v13.5,8 13.5,8.4 13.25,8.65 12.44,8.65 U2.P$3
FT232_VCCD  (via drill 0.2)
  Top 0.152: U5.12 21.2,7.8 21.35,7.65 | C14.2 21.35,7.65 | 21.35,7.65 21.35,6.85 v21.15,6.65 | U5.39 12.7,13.45 12.4,13.75 C11.2 11.86,14.34 11.35,14.85 v10.85,14.85 LED2.A 9.7,14.6 8.35,14.6 8.1,14.85 LED1.A | U5.46 12.45,9.95 12.35,9.85 C16.2 11.12,9.36 11.12,9.35 | 11.12,9.35 FB2.1 | C15.2 21.56,15.81 v21.2,15.45 U5.24 | v10.15,9.35 11.12,9.35
  Route15 0.152: v10.85,14.85 11.35,14.85 12.3,13.9 12.3,9.35 | 12.3,9.35 v10.15,9.35 | v21.15,6.65 21.15,8.6 | 21.15,8.6 12.5,8.6 12.3,8.8 12.3,9.35 | 21.15,8.6 21.2,8.65 v21.2,15.45
  Bottom 0.152: FB1.1 v21.15,6.65 21.15,5.58 R7.1 21.15,5.55 | R10.1 13.52,15.67 12.9,15.05 | 12.9,15.05 12.6,14.75 C13.1 10.95,14.75 v10.85,14.85 | 14.55,11.53 U6.6 14.56,12.41 14.75,12.6 15.1,12.6 16.95,12.6 17.05,12.7 C20.2 20.24,12.69 21.2,13.65 v21.2,15.45 | R12.1 R13.1 15.48,8.64 U2.P$4 | R11.1 13.15,14.8 12.9,15.05 | C19.2 13.36,7.11 13.75,7.5 14.25,7.5 14.55,7.8 14.55,8.62 U2.P$4 | U2.P$4 14.53,9.27 14.3,9.5 11.7,9.5 11.55,9.35 v10.15,9.35
GND  (via drill 0.2)  (2 unrouted)
  Top 0.152: C18.1 16.05,6.89 U5.4 16.05,9 | C17.1 U5.10 19.05,9.4 19,9.45 | 16.05,9 16.05,9.8 16.2,9.95 | U5.36 14.55,14.15 14.5,14.1 14.5,12.45 | 14.5,12.45 14.5,10.6 15.38,9.72 | 15.38,9.72 16.1,9 | U5.23 19.55,13.95 U5.THERMAL | C15.1 20.64,14.99 20.55,14.9 20.5,14.9 19.43,13.82 19.48,13.82 19.5,13.8 19.4,13.8 U5.THERMAL | v10.75,12.6 11.3,12.6 11.96,11.94 C10.1 U5.42 | C16.1 13.19,8.44 13.4,8.65 U5.48 U5.47 15.1,9.45 15.38,9.72 | U5.THERMAL 17.3,10.25 16.05,9 | U5.41 14.5,12.45
  Bottom 0.152: C41.1 39.84,22.51 C42.2
  other vias: 38.35,17.25 33.88,17.25 36.1,19.5 38.35,21.72 33.88,21.72 42.8,20.75 6.2,29.3 14.65,30.55 12.85,17 19.55,16.7 4.2,21.4 10.2,20.6 16.2,21.4 22.2,21.4 45.6,14.05 28.45,15.65 37.85,29.6 42.7,32.25 33.3,31.85 30.78,27.17 18.9,3.2 18.25,3.2 36.15,11.1 30.5,11.15
  pour Top: -1,-1 71,-1 71,41 -1,41
  pour Route2: -1,-1 71,-1 71,41 -1,41
  pour Bottom: -1,-1 71,-1 71,41 -1,41
HM01B0_+1V8  (via drill 0.2)
  Top 0.152: J1.P$10 v49.35,18.25 | R28.1 R29.1 54.93,24.98 v54.2,24.25
  Route15 0.152: v49.35,18.25 46.65,18.25 46.2,18.7 46.2,20.3 47.15,21.25 49.85,21.25 50.45,21.85 50.45,23.55 51.15,24.25 v54.2,24.25
  Bottom 0.152: JP16.2 47.1,16.95 47.3,17.15 48.95,17.15 49.35,17.55 v49.35,18.25
HM01B0_+2V8  (via drill 0.2)
  Top 0.152: v47.95,19.45 47.95,18.95 47.75,18.75 J1.P$11 | v45.45,15.25 J1.P$4
  Bottom 0.152: v47.95,19.45 47.6,19.45 47.1,18.95 JP17.2 47.1,17.5 46.85,17.25 45.6,17.25 45.45,17.1 v45.45,15.25
HM01B0_D0  (via drill 0.2)
  Top 0.152: U8.35 40.95,21.75 42.45,20.25 J1.P$14 45,20.25 45.5,20.75 50.3,20.75 50.36,20.81 v54.2,20.81
  Bottom 0.152: TP9.TP v54.19,20.8 v54.2,20.81
HM01B0_D1  (via drill 0.2)
  Top 0.152: U8.23 38.35,15.43 38.73,15.05 41.6,15.05 41.9,14.75 J1.P$3 49.5,14.75 v49.85,14.4
  Bottom 0.152: TP1.TP v49.85,14.4
HM01B0_D2  (via drill 0.2)
  Top 0.152: U8.31 40.9,19.75 42.9,17.75 J1.P$9 49.55,17.75 50.2,18.4 v54.2,18.4
  Bottom 0.152: TP6.TP v54.2,18.4
HM01B0_D3  (via drill 0.2)
  Top 0.152: U8.25 41.5,16.75 42.5,15.75 J1.P$5 48.5,15.75 49.05,15.2 v54.15,15.2
  Bottom 0.152: v54.15,15.2 TP2.TP
HM01B0_D4  (via drill 0.2)
  Top 0.152: U8.32 41.5,20.25 42.5,19.25 J1.P$12 45.1,19.25 45.85,20 49.8,20 50.2,19.6 v50.2,19.2
  Bottom 0.152: v50.2,19.2 TP7.TP
HM01B0_D5  (via drill 0.2)
  Top 0.152: U8.40 37.35,23.95 37.95,24.55 40.3,24.55 40.6,24.25 41.5,24.25 42.51,23.24 42.96,23.24 42.97,23.25 J1.P$20 48.45,23.25 v49.45,24.25
  Bottom 0.152: v49.45,24.25 50,24.8 TP14.TP
HM01B0_D6  (via drill 0.2)
  Top 0.152: U8.39 37.85,23.8 38.1,24.05 40.3,24.05 40.6,23.75 41.5,23.75 42.5,22.75 J1.P$19 48.75,22.75 v49.25,23.25
  Bottom 0.152: v49.25,23.25 50,24 TP13.TP
HM01B0_D7  (via drill 0.2)
  Top 0.152: U8.34 40.3,21.25 40.4,21.35 40.8,21.35 41,21.15 41.05,21.15 42.45,19.75 J1.P$13 45,19.75 45.65,20.4 53.8,20.4 v54.2,20
  Bottom 0.152: TP8.TP v54.2,20
HM01B0_HS  (via drill 0.2)
  Top 0.152: U8.36 41.4,22.25 42.4,21.25 J1.P$16 44.85,21.25 45,21.1 49.95,21.1 50.45,21.6 v54.2,21.6
  Bottom 0.152: TP10.TP v54.2,21.6
HM01B0_INT  (via drill 0.2)
  Top 0.152: U8.38 38.35,23.45 38.45,23.55 40.3,23.55 40.6,23.25 41.5,23.25 42.5,22.25 J1.P$18 45.07,22.25 45.25,22.43 49.33,22.43 50.3,23.4 v54.2,23.4 56.1,23.4 56.75,24.05 56.75,30.8 55.8,31.75 v53.85,31.75 | LED3.C v28.3,33.8
  Bottom 0.152: TP12.TP 54,23.2 v54.2,23.4 | v28.3,33.8 28.3,35.8 28.7,36.2 52.75,36.2 53.85,35.1 v53.85,31.75
HM01B0_MCK  (via drill 0.2)
  Top 0.152: U8.28 41.5,18.25 42.5,17.25 J1.P$8 49.8,17.25 v50.15,17.6
  Bottom 0.152: v50.15,17.6 TP5.TP
HM01B0_PCLK  (via drill 0.2)
  Top 0.152: U8.37 40.35,22.9 40.5,22.75 41.5,22.75 42.5,21.75 J1.P$17 44.87,21.75 45.17,21.45 49.35,21.45 v49.8,21.9
  Bottom 0.152: TP11.TP 50.3,22.4 v49.8,21.9
HM01B0_SCL  (via drill 0.2)
  Top 0.152: U8.41 36.85,24.05 37.85,25.05 40.3,25.05 40.6,24.75 41.5,24.75 42.5,23.75 J1.P$21 48.2,23.75 48.95,24.5 48.95,25.5 49.3,25.85 | 49.3,25.85 v49.7,26.25 | R29.2 49.55,25.6 49.3,25.85
  Bottom 0.152: v49.7,26.25 50.35,25.6 TP15.TP
HM01B0_SDA  (via drill 0.2)
  Top 0.152: U8.42 36.35,24.1 37.8,25.55 40.3,25.55 40.6,25.25 41.5,25.25 42.5,24.25 42.53,24.25 42.54,24.26 42.96,24.26 42.97,24.25 J1.P$22 48.15,24.25 48.6,24.7 48.6,26.35 v49.2,26.95 50.52,26.95 51.07,26.4 R28.2
  Bottom 0.152: TP16.TP 51.05,26.4 50.5,26.95 v49.2,26.95
HM01B0_TRIG  (via drill 0.2)
  Top 0.152: U8.27 41.5,17.75 42.5,16.75 J1.P$7 49.5,16.75 49.55,16.8 v54.2,16.8 56.4,16.8 57.8,18.2 57.8,30.95 56.1,32.65 v54.35,32.65 | LED4.C 26.1,34.65 25.35,35.4 v25.35,36.65
  Bottom 0.152: v54.2,16.8 TP4.TP | v25.35,36.65 25.4,36.6 52.95,36.6 54.35,35.2 v54.35,32.65
HM01B0_VS  (via drill 0.2)
  Top 0.152: U8.26 41.5,17.25 42.5,16.25 J1.P$6 49.6,16.25 v49.85,16
  Bottom 0.152: v49.85,16 TP3.TP
I2S_DATA  (via drill 0.2)
  Top 0.152: U8.18 35.85,13.7 36.45,13.1 v37.3,13.1 | JP40.25 v55,10.95
  Bottom 0.152: v37.3,13.1 37.55,12.85 41.85,12.85 43.3,11.4 45.85,11.4 46.1,11.15 54,11.15 54.2,10.95 v55,10.95 55.9,10.95 56.45,11.5 56.45,14.05 57.25,14.85 60.15,14.85 60.65,14.35 | U13.P$6 61,14 60.65,14.35 | 60.65,14.35 61.85,15.55 61.85,22.25 61,23.1 61,27.3 U12.P$6
ICE40_+1V2_CORE  (via drill 0.2)
  Top 0.152: v40.35,19.25 U8.30 | v31.55,20.55 31.85,20.25 U8.5
  Route15 0.305: v31.55,20.55 32.85,19.25 35.25,19.25 35.7,18.8 36.65,18.8 37.1,19.25 v40.35,19.25
  Bottom 0.152: C36.2 C37.2 40.11,19.94 40.35,19.7 v40.35,19.25 | C34.2 | C34.2 C35.2 | JP5.2 29.9,20.05 30.05,19.9 31.55,19.9 31.7,20.05 | 31.7,20.05 32.25,20.05 32.35,20.15 C34.2 | v31.55,20.55 31.55,20.2 31.7,20.05
ICE40_+1V2_PLL
  Bottom 0.152: R25.1 42.02,16.82 42.25,17.05 43.35,17.05 43.6,16.8 JP6.2
ICE40_CRESETB  (via drill 0.2)
  Top 0.152: U8.8 v31.85,18.75 | v22.35,12.45 U5.20 | SW1.P$2 8.05,11.95 | 8.05,11.95 v8.05,8.6 7.95,8.5 SW1.P$1 | JP31.1 4.9,15.7 5.4,15.2 5.4,12.75 6.2,11.95 8.05,11.95
  Route15 0.152: v8.05,8.6 9.65,7 19.35,7 20.55,5.8 21.35,5.8 21.65,6.1 21.65,7.05 21.55,7.15 21.55,11.65 v22.35,12.45
  Bottom 0.152: R26.2 32.15,19.05 v31.85,18.75 | v31.85,18.75 26.6,18.75 26.15,19.2 24.4,19.2 22.45,17.25 22.45,12.55 v22.35,12.45 | C54.2 32.45,18.15 v31.85,18.75
ICE40_FLASH_CIPO  (via drill 0.2)
  Top 0.152: U8.17 35.35,12.9 v35.8,12.45 | U5.15 22.35,9.95 | 22.35,9.95 22.9,9.95 25.82,12.87 U7.2 25.82,14.31 26.01,14.5 v27.7,14.5 | v22.35,10.45 22.35,9.95 | v63.4,10.85 63.4,8.35 62.65,7.6 59.85,7.6 59.45,8 59.45,8.9 58.25,10.1 v56.95,10.1 56.95,15.1 60.1,18.25 v60.1,27.25
  Bottom 0.152: v27.7,14.5 31.1,14.5 32.1,13.5 34.75,13.5 v35.8,12.45 41.6,12.45 43.05,11 45.45,11 45.8,10.65 54,10.65 54.55,10.1 v56.95,10.1 | v22.35,10.45 22.35,9.05 22.75,8.65 22.75,7.9 25.35,5.3 33.35,5.3 JP40.9 | U13.P$1 v63.4,10.85 | v60.1,27.25 U12.P$1
ICE40_FLASH_COPI  (via drill 0.2)
  Top 0.152: U5.14 v22.9,9.45 23.45,9.45 24.2,8.7 24.2,6.35 25.05,5.5 27.45,5.5 28,4.95 28.62,4.95 JP40.5 | U8.14 33.85,15.48 v33.65,15.28 | U7.5 28.73,19.37 29,19.1 v29,17.3 29.5,16.8 v29.5,13.2
  Bottom 0.152: v33.65,15.28 33.12,15.28 31.95,16.45 29.55,16.45 29,17 v29,17.3 | v29.5,13.2 29.1,13.2 28.15,12.25 24.5,12.25 22.9,10.65 v22.9,9.45
ICE40_FLASH_PS  (via drill 0.2)
  Top 0.152: R19.2 23.85,14.05 24.22,13.68 U7.1 | U5.17 22.4,10.95 | 22.4,10.95 23.15,10.95 24.55,12.35 U7.1 | U8.16 v34.85,14.2 | U7.1 24.58,13.65 v25.2,13.65 | 22.4,10.95 22.4,11.55 v22.6,11.75
  Bottom 0.152: v34.85,14.2 32.35,14.2 31.4,15.15 26.7,15.15 v25.2,13.65 | v22.6,11.75 22.1,11.75 21.75,11.4 21.75,8.85 22.25,8.35 22.25,6.24 JP40.1
ICE40_FLASH_SCK  (via drill 0.2)
  Top 0.152: R18.2 27,21.4 27.09,21.31 U7.6 27.09,18.66 27.25,18.5 28.2,18.5 28.45,18.25 28.45,16.6 v28.6,16.45 29,16.05 v29,12.4 | U8.15 v34.35,15.2 | U5.13 23.15,8.95 v23.6,8.5 23.6,8.05 23.8,7.85 23.8,6.15 25.05,4.9 26.13,4.9 JP40.3 | v61,10.05 v61,16.7 v61,28.95
  Bottom 0.152: 34.35,14.8 32.55,14.8 31.45,15.9 29.15,15.9 v28.6,16.45 | v34.35,15.2 34.35,14.8 | 34.35,14.8 34.95,14.8 36.2,13.55 36.37,13.55 36.5,13.42 36.94,13.42 37.11,13.6 37.95,13.6 38.2,13.35 42.3,13.35 43.8,11.85 46.2,11.85 46.4,11.65 54.25,11.65 54.45,11.45 55.25,11.45 55.9,12.1 55.9,14.25 58.35,16.7 v61,16.7 | v29,12.4 28.5,11.9 24.8,11.9 23.6,10.7 v23.6,8.5 | U13.P$4 60.99,10.04 v61,10.05 | U12.P$4 61.89,28.95 v61,28.95
ICE40_GPIO43  (via drill 0.2)
  Top 0.152: U8.43 35.85,24.2 37.85,26.2 v43.25,26.2 | SW2.P$1 SW2.P$2 56.65,37.8 v55.25,36.4 32.25,36.4 32,36.15 LED5.A R38.2
  Bottom 0.152: v43.25,26.2 45.65,26.2 48.85,29.4 54.35,29.4 55.25,30.3 v55.25,36.4
ICE40_OSC_12M
  Top 0.152: U8.20 36.85,14.6 38.16,13.29 40.26,13.29 43.2,10.35 44.05,10.35 44.5,9.9 44.5,7.45 44.75,7.2 U11.P$3 45.7,5.95 46.1,5.55 50.15,5.55 50.75,4.95 51.48,4.95 JP40.23
ICE40_OSC_VCC  (via drill 0.2)
  Top 0.152: U11.P$4 | U11.P$4 47.8,7.3 47.76,7.26 | R31.1 51.08,9.98 50.8,9.7 50.55,9.7 49.9,9.05 v49.4,9.05 48.95,8.6 C49.2 47.86,7.26 U11.P$4
  Bottom 0.152: JP19.2 v49.4,9.05
ICE40_SPI_VCCIO1  (via drill 0.2)
  Top 0.152: U8.22 37.85,15.21 v37.9,15.17
  Route15 0.305: v37.9,15.17 37.9,12.14 v37,11.25
  Bottom 0.152: C40.1 37.02,15.13 C39.2 37.08,15.17 v37.9,15.17 | 36,15.12 C40.1 | JP8.2 37.25,9.4 37,9.65 v37,11.25 | C40.1 36.02,15.83 35.85,16 35.15,16 34.55,16.6 34.55,18.73 R26.1
ICE40_VCCIO0  (via drill 0.2)
  Top 0.152: v40.55,20.75 U8.33
  Bottom 0.152: v40.55,20.75 C41.2 40.19,21.59 40.15,21.55 39.7,21.55 39.55,21.4 C42.1 | JP13.2 JP9.2
  Bottom 0.229: v40.55,20.75 41.25,20.05 46.35,20.05 47.1,20.8 JP13.2
ICE40_VCCIO2  (via drill 0.2 pad 0.25)
  Top 0.152: U8.1 31.85,22.25 v31.8,22.3
  Bottom 0.152: C44.1 32.75,22.56 C43.2 32,22.5 v31.8,22.3 31.35,22.3 30.65,23 JP20.2 JP14.2
ICE40_VCCPLL  (via drill 0.2)
  Top 0.152: U8.29 40.1,18.75 40.17,18.67 40.72,18.67 v40.95,18.9
  Bottom 0.152: C32.2 40.29,18.21 40.45,18.05 C33.1 | R25.2 40.52,17.78 C33.1 | C33.1 40.45,18.5 40.6,18.65 40.7,18.65 v40.95,18.9
ICE40_VPP2V5_+3V3  (via drill 0.2)
  Top 0.152: U8.24 39.35,16.1 39.47,15.98 v39.47,15.57
  Route15 0.305: v41.6,9.15 40.05,9.15 39.47,9.73 v39.47,15.57
  Bottom 0.152: C38.2 39.11,15.93 v39.47,15.57 | JP7.2 41.35,9.4 v41.6,9.15
MEAS_1V2
  Bottom 0.152: 13.3,31.28 U9.1 14.37,31.22 15.05,31.9 20.2,31.9 20.8,32.5 JP10.1
MEAS_1V8
  Bottom 0.152: U9.7 11.88,27.32 11.5,27.7 11.5,31.9 11.95,32.35 16.75,32.35 17.3,32.9 JP11.1
MEAS_2V8
  Bottom 0.152: U9.14 7.48,31.83 8.4,32.75 9.55,32.75 10.3,33.5 JP15.1
MEAS_3V3
  Bottom 0.152: U9.8 9.27,27.32 10.1,28.15 10.1,32.3 10.65,32.85 13.45,32.85 13.8,33.2 JP12.1
MEM1_!HOLD  (via drill 0.2)
  Top 0.152: U8.10 31.9,17.75 31.4,17.25 31.4,16.3 31.8,15.9 31.8,14.25 32.9,13.15 32.9,11.3 32.4,10.8 v32.4,9.35 32.38,9.34 U16.7 | U17.7 40.87,9.29 41.05,9.1 41.05,8.7 41.5,8.25 v41.5,7.9
  Route2 0.152: v41.5,7.9 41.5,6.25 42.5,5.25 43.56,5.25 JP40.17
  Bottom 0.152: v32.4,9.35 32.85,8.9 35.45,8.9 36.55,7.8 41.4,7.8 v41.5,7.9
MEM1_!WP  (via drill 0.2)
  Top 0.152: U8.7 31.55,19.25 30.85,18.55 30.85,13.3 | 30.85,13.3 30.85,12.35 29.75,11.25 27.85,11.25 27.4,11.7 26.85,11.7 26.6,11.45 26.6,8.3 26.36,8.06 U16.3 | v35.35,11.45 35.35,8.85 35.05,8.55 34.65,8.55 34.53,8.44 U17.3 34.53,7.58 34.4,7.45 34.15,7.45 33.7,7 33.7,6.35 34,6.05 38.95,6.05 39.75,5.25 41.02,5.25 JP40.15 | 30.85,13.3 v31.2,13.3
  Bottom 0.152: v31.2,13.3 32.15,12.35 34.45,12.35 v35.35,11.45
MEM1_CIPO  (via drill 0.2)
  Top 0.152: U8.6 30.35,19.75 29.6,19 29.6,17.4 29.95,17.05 29.95,13.8 30.05,13.7 30.05,12.75 29.16,11.86 28.1,11.86 27.65,12.31 26.58,12.31 25.37,11.1 25.15,11.1 24.55,10.5 v24.55,9.35 | U17.2 34.53,9.69 v34.3,9.93 | U16.2 24.57,9.34 v24.55,9.35 | v24.55,9.35 24.55,8.35 24.7,8.2 24.7,6.45 25.15,6 28.42,6 29.17,5.25 30.86,5.25 JP40.7
  Bottom 0.152: v24.55,9.35 24.65,9.25 24.65,7.85 25.45,7.05 28.7,7.05 32.18,10.53 33.7,10.53 v34.3,9.93
MEM1_COPI  (via drill 0.2)
  Top 0.152: U8.12 32.7,14.7 33.8,13.6 33.8,10.95 33.35,10.5 33.35,8.8 33.5,8.65 v33.5,7.55 32.74,6.79 U16.5 | U17.5 42.2,6.75 42.77,7.33 | 42.77,7.33 v43.1,7.65 | 42.77,7.33 44.65,5.45 45.4,5.45 45.7,5.15 48.74,5.15 JP40.21
  Bottom 0.152: v33.5,7.55 35.1,7.55 35.9,6.75 42.2,6.75 v43.1,7.65
MEM1_PS1  (via drill 0.2)
  Top 0.152: U8.9 31.45,18.25 v31.35,18.15 | v30.25,17.9 30.25,17.45 30.4,17.3 30.4,14 30.45,13.95 30.45,12.6 29.41,11.55 27.98,11.55 27.53,12.01 26.7,12.01 25.73,11.04 U16.1 25.73,10.09 25.6,9.95 v25.25,9.95
  Bottom 0.152: v30.25,17.9 30.5,18.15 v31.35,18.15 | v25.25,9.95 24.3,9.95 24.07,9.72 24.07,8.93 24.2,8.8 24.2,7.3 25.45,6.05 33.3,6.05 34.1,5.25 35.94,5.25 JP40.11
MEM1_PS2  (via drill 0.2)
  Top 0.152: U8.13 33.35,15.66 33.17,15.48 33.17,15.03 34.45,13.75 v34.45,11.4 34.45,10.64 U17.1
  Bottom 0.152: v34.45,11.4 34.45,10.75 34.95,10.25 34.95,9.65 34.65,9.35 33.55,9.35 32.9,10 32.3,10 31.4,9.1 31.4,7.55 32.1,6.85 33.15,6.85 34.3,5.7 36.7,5.7 37.15,5.25 38.48,5.25 JP40.13
MEM1_SCK  (via drill 0.2)
  Top 0.152: U8.11 32.1,17.25 31.85,17 31.85,16.45 32.25,16.05 32.25,14.45 33.35,13.35 33.35,11.15 32.9,10.7 v32.9,8.1 32.87,8.06 U16.6 | U17.6 40.16,7.58 40.4,7.35 41.95,7.35 v42.3,7.7
  Route2 0.152: v42.3,7.7 44.84,5.16 46.19,5.16 46.65,4.7 JP40.19
  Bottom 0.152: v32.9,8.1 35.4,8.1 36.15,7.35 41.95,7.35 v42.3,7.7
MEM1_VCC1  (via drill 0.2)
  Top 0.152: U16.8 31.36,10.12 31.25,10 v30.7,10 | C60.2 C59.2 | 32.31,11.66 C59.2 | U16.8 31.36,10.71 | C59.2 32.31,11.31 32.1,11.1 31.55,11.1 31.36,10.91 U16.8
  Bottom 0.152: JP23.2 28.3,8.7 29.6,10 v30.7,10
MEM1_VCC2  (via drill 0.2)
  Top 0.152: v43.95,9.55 42.8,9.55 42.45,9.9 42.45,10.3 42.05,10.7 41.5,10.7 41.4,10.8 C62.2 | C62.2 | 40.16,10.56 U17.8 | C62.2 41.06,10.86 40.76,10.56 40.16,10.56 | C61.2 39.9,11.7 40.16,11.44 40.16,10.56
  Bottom 0.152: JP24.2 43.8,9.4 v43.95,9.55
MEM2_!WP  (via drill 0.2)
  Top 0.152: U8.2 31.5,21.75 31.15,22.1 31.15,24.35 32.1,25.3 32.5,25.3 33.05,25.85 33.05,29.85 33.35,30.15 33.35,30.25 | 33.35,30.25 v33.35,30.85 | U15.P$3 33.37,30.23 33.35,30.25 | U14.P$3 43,30.65 42.75,30.9 v42.2,30.9
  Bottom 0.152: v33.35,30.85 40.65,30.85 | 40.65,30.85 41.7,30.85 41.75,30.9 v42.2,30.9 | 40.65,30.85 40.65,32.55 41.25,33.15 42.4,33.15 43.1,33.85 44.93,33.85 JP41.5
MEM2_CIPO1  (via drill 0.2)
  Top 0.152: U8.45 34.85,24.55 37.2,26.9 41.3,26.9 41.6,27.2 41.6,28.7 v41.85,28.95 41.87,28.96 U14.P$2
  Bottom 0.152: v41.85,28.95 42.85,29.95 42.85,31.2 43.35,31.7 43.35,32.95 43.75,33.35 46.97,33.35 JP41.3
MEM2_CIPO2
  Top 0.152: U8.48 33.35,24.7 33.45,24.8 33.45,28.75 33.66,28.96 U15.P$2 35.16,28.96 35.3,29.1 35.3,32.2 36.25,33.15 36.61,33.15 JP41.11
MEM2_COPI1
  Top 0.152: U8.46 34.35,25.75 36.1,27.5 36.1,31.35 36.26,31.5 U14.P$5 37.8,31.5 37.95,31.65 37.95,32.6 38.45,33.1 40,33.1 40.75,33.85 42.39,33.85 JP41.7
MEM2_COPI2
  Top 0.152: U8.4 32.25,20.75 31.95,21.05 28.9,21.05 26.9,23.05 26.9,31.15 27.25,31.5 U15.P$5 28.4,32.5 29.15,33.25 31.6,33.25 33.48,35.13 JP41.15
MEM2_PS1
  Top 0.152: U8.44 35.35,24.4 37.5,26.55 42.5,26.55 43,27.05 U14.P$1 43,28.15 43.15,28.3 43.65,28.3 44.9,29.55 44.9,32.35 45.8,33.25 49.41,33.25 JP41.1
MEM2_PS2
  Top 0.152: U8.47 33.85,24.6 33.95,24.7 33.95,26.4 34.4,26.85 U15.P$1 35.2,27.7 35.7,28.2 35.7,31.9 36.55,32.75 37.25,32.75 38.35,33.85 39.85,33.85 JP41.9
MEM2_SCK  (via drill 0.2)
  Top 0.152: v38.1,30.25 38.09,30.23 U14.P$6 | U8.3 32.2,21.25 32.05,21.4 29.15,21.4 27.25,23.3 27.25,29.95 27.54,30.23 U15.P$6 28.4,30.65 28.65,30.9 v29.2,30.9 29.3,31
  Bottom 0.152: v29.2,30.9 29.85,30.25 32.35,30.25 | 32.35,30.25 v38.1,30.25 | 32.35,30.25 32.35,32.6 32.7,32.95 33.87,32.95 JP41.13
MEM2_VCC1  (via drill 0.2)
  Top 0.152: v36.5,26.95 36.5,27.6 36.59,27.7 U14.P$8 U14.P$7
  Bottom 0.152: 37.14,27.1 C55.2 C57.2 | JP25.2 JP26.2 45.75,28.45 45.1,27.8 42.95,27.8 40.1,27.8 39.4,27.1 37.14,27.1 | v36.5,26.95 36.99,26.95 37.14,27.1
MEM2_VCC2  (via drill 0.2)
  Top 0.152: C58.2 C56.2 29.74,27.11 29.16,27.7 U15.P$8 U15.P$7 28.4,28.61 28.66,28.35 v29.2,28.35
  Bottom 0.152: JP27.2 JP28.2 25.55,29.1 25.85,28.8 28.55,28.8 29,28.35 v29.2,28.35
MIC1_VCC
  Bottom 0.152: C50.2 C51.2 | JP29.2 63.05,27.92 C50.2 | U12.P$5 62.36,28.14 62.55,27.95 C50.2
MIC2_VCC
  Bottom 0.152: C53.2 JP30.2 | C52.2 C53.2 | C53.2 59.15,10.86 U13.P$5
N$1
  Top 0.152: R5.2 24.6,23.28 R6.1 24.6,21.91 24.5,21.81 24.11,21.81 23.49,21.19 U4.4
N$2
  Top 0.152: U1.4 12.2,20.45 12.3,20.35 12.7,20.35 | 12.7,20.35 R2.1 | R1.2 12.7,20.35
N$3  (via drill 0.2)
  Top 0.152: R24.1 20.25,27.8 | 20.25,27.8 20.65,27.8 20.7,27.75 20.7,27.25 20.93,27.02 JP3.2 | v12,29.95 12.1,30.05 19.7,30.05 20.25,29.5 20.25,27.8
  Bottom 0.152: U9.3 12.03,29.92 v12,29.95
N$4
  Top 0.152: FB2.2 12.13,7.87 12.55,7.45 13.9,7.45 14.6,6.75 C18.2 15.39,7.14 15.55,7.31 U5.3
N$5  (via drill 0.2)
  Top 0.152: U5.8 18.05,6.74 C17.2 18.14,6.01 v18.4,5.75
  Bottom 0.152: v18.4,5.75 18.4,6.63 FB1.2
N$6
  Top 0.152: R3.2 18.7,20.35 | 18.7,20.35 R4.1 | U3.4 18.25,20.45 18.35,20.35 18.7,20.35
N$7
  Bottom 0.152: U2.P$1 15.56,6.74 17.25,5.05 19.15,5.05 19.65,5.55 R7.2
N$8
  Bottom 0.152: R9.1 14.53,13.88 | 14.53,13.88 U6.1 | R11.2 14.53,13.88
N$9
  Top 0.152: R8.2 13.58,6.27 13.75,6.1 16.35,6.1 16.55,6.3 U5.5
N$10  (via drill 0.2)
  Top 0.152: v11,11.9 11.38,11.9 11.86,11.42 12.64,11.42 12.67,11.45 U5.43
  Bottom 0.152: v11,11.9 11.35,12.25 12.85,12.25 13.15,12.55 13.15,12.75 13.32,12.92 R9.2 16.22,12.92 16.46,13.16 U6.3
N$11  (via drill 0.2)
  Top 0.152: U5.45 11.3,10.45 v11.1,10.25
  Bottom 0.152: v11.1,10.25 11.3,10.45 14.7,10.45 14.9,10.65 15.1,10.65 15.35,10.65 15.52,10.81 U6.5 15.52,12.06 15.7,12.25 17.05,12.25 17.25,12.05 17.25,8.8 17,8.55 R13.2
N$12  (via drill 0.2)
  Top 0.152: U5.44 10.9,10.95 v10.85,10.9
  Bottom 0.152: v10.85,10.9 10.35,10.4 10.35,10.05 10.65,9.75 11.5,9.75 11.85,10.1 15,10.1 15.15,10.25 16.43,10.25 16.46,10.21 | U6.4 16.46,10.21 | 16.46,10.21 16.46,9.42 R12.2
N$13
  Top 0.152: U5.32 16.55,16.95 15.65,17.85 7.6,17.85 7.1,17.35 R14.1
N$14  (via drill 0.2)
  Top 0.152: U5.34 v15.55,16.55 C21.2
  Bottom 0.152: R10.2 v15.55,16.55
N$15
  Top 0.152: R14.2 7.1,15.49 7.2,15.59 7.94,15.59 8.05,15.7 LED1.C
N$16
  Top 0.152: U5.31 17.05,16.15 17.23,16.33 17.48,16.33 17.61,16.46 R16.2 R17.1
N$17
  Top 0.152: U5.33 16.05,16.9 15.45,17.5 9.4,17.5 9,17.1 R15.1
N$18
  Top 0.152: R15.2 9,15.49 9.1,15.59 9.79,15.59 9.95,15.75 LED2.C
N$19  (via drill 0.2)
  Top 0.152: U7.3 27.09,13.06 27.3,12.85 v28,12.85 | v23.3,12.5 23.3,13.22 R20.2
  Bottom 0.152: v28,12.85 23.65,12.85 v23.3,12.5
N$20
  Top 0.152: U7.7 26.17,19.37 26.58,19.78 R21.2
N$21  (via drill 0.2)
  Top 0.152: v14.5,28.8 14.25,28.55 14.25,28.2 R23.1 14.65,27.8 14.7,27.75 14.7,27.25 14.93,27.02 JP2.2
  Bottom 0.152: U9.5 14.32,28.62 v14.5,28.8
N$22  (via drill 0.2)
  Top 0.152: JP1.2 8.95,25.42 8.95,27 8.7,27.25 8.7,27.75 8.65,27.8 R22.1 8.25,28.2 8.25,28.65 8.9,29.3 v8.9,29.75
  Bottom 0.152: U9.10 8.52,28.62 8.9,29 v8.9,29.75
N$28
  Top 0.152: R30.2 6.7,20.35 | 6.7,20.35 R33.1 | U10.4 6.15,20.45 6.25,20.35 6.7,20.35
N$29  (via drill 0.2)
  Top 0.152: R32.1 2.25,27.8 | 2.25,27.8 2.65,27.8 2.7,27.75 2.7,27.2 2.93,26.97 JP18.2 | 2.25,27.8 2.25,29.45 v2.75,29.95
  Bottom 0.152: U9.12 2.72,29.92 v2.75,29.95
N$30
  Top 0.152: U11.P$1 47.8,10.7 48.35,11.25 50.12,11.25 | 50.12,11.25 R31.2 | JP21.1 50.15,11.28 50.12,11.25
N$31
  Top 0.152: R27.2 LED3.A
N$33
  Top 0.152: R37.2 LED4.A
QWIIC_+3V3  (via drill 0.2)
  Top 0.152: 67.05,4.3 67.05,8 66.83,8.22 R34.1 R35.1
  Top 0.305: v67.05,3.6 67.05,4.3 J3.P$2
  Bottom 0.305: JP22.2 v67.05,3.6
QWIIC_SCL  (via drill 0.2)
  Top 0.152: R35.2 65.15,9.85 64.5,9.2 J3.P$4 59.6,6.3 v58.85,7.05 56.45,9.45 56.45,11.45 55.35,12.55 v54.2,12.55 | U8.21 37.35,14.7 37.65,14.4 v38.55,14.4
  Bottom 0.152: v38.55,14.4 43.2,14.4 44.15,13.45 53.3,13.45 v54.2,12.55 | JP40.27 57.54,5.74 v58.85,7.05
QWIIC_SDA  (via drill 0.2)
  Top 0.152: R34.2 65.87,8.07 65.65,7.85 65.65,5.5 65.45,5.3 J3.P$3 60,5.3 | U8.19 36.35,14.25 v36.7,13.9 | v54.85,12 55.3,12 56.05,11.25 56.05,8.9 59.65,5.3 60,5.3 | 60,5.3 60.08,5.22 JP40.29
  Bottom 0.152: v36.7,13.9 42.85,13.9 43.75,13 52.9,13 53.9,12 v54.85,12
VCCA
  Top 0.152: U5.37 13.4,15.2 13.2,15.4 12.65,15.4 C4.2
VCCCORE
  Top 0.152: C5.2 11.82,14.88 12,14.7 12.4,14.7 12.55,14.55 12.55,14.15 12.75,13.95 U5.38
VUSB  (via drill 0.2)
  Top 0.152: C1.2 12.6,2.9 12.8,3.1 16.1,3.1 16.3,3.3 J2.1 16.3,5.2 16.05,5.45 15.75,5.45 | C10.2 | 2.95,18.45 2.94,18.46 C45.2 2.91,19.33 U10.3 2.15,20.45 1.95,20.65 1.95,22.15 2.15,22.35 U10.1 | 8.95,18.55 8.94,18.56 C2.2 8.94,20.42 U1.3 8.1,20.45 7.95,20.6 7.95,22.25 8.05,22.35 U1.1 | 14.95,18.55 C6.2 14.91,19.33 U3.3 14.2,20.45 14.1,20.55 14.1,22.25 14.2,22.35 U3.1 | 20.94,18.55 C8.2 20.91,19.33 U4.3 20.25,20.45 20.1,20.6 20.1,22.2 20.25,22.35 U4.1 | R16.1 17.61,18.54 17.6,18.55 | U5.40 12.34,12.95 C10.2 | C10.2 12.15,12.96 11.84,12.96 11.6,13.2 10.6,13.2 v9.9,12.5
  Top 0.457: 15.75,5.45 v11.74,5.45 | 20.94,18.55 17.6,18.55 14.95,18.55 8.95,18.55 6.45,18.55 v6.35,18.45 2.95,18.45
  Route15 0.813: v11.74,5.45 8.85,5.45 6.35,7.95 6.35,12.5 | v6.35,18.45 6.35,12.5 | v9.9,12.5 6.35,12.5
  Bottom 0.152: C12.1 12.2,13.2 10.6,13.2 v9.9,12.5

## Text on the board
tPlace: gnd | 100mV / / mA | 4 | 3 | 48 | 47 | 46 | 2 | 45 | 44 | +2v8 | +3v3 | +1v8 | +1v2 | +2v8 | +3v3 | +1v8 | +1v2 | milliLearn/iCE40 | Ka Moamoa | Sparkfun / QWIIC | 16 | 15 | 14 | 6 | 17 | 9 | 13 | 7 | 10 | 11 | 12 | 20 | 18 | 21 | 19
bPlace: SJ5376 | foot | MEM2_1 | 3V3 | 3V3 | IGNR | VCCIO2 | 1V8 | IGNR | MEM2_2 | MEAS | MEAS | 1V8 | MEAS | IGNR | VCCIO0 | GND | IGNR | MEAS | 3V3 | SCL | SDA | 3V3 | MIC1 | D5 | 1V8 | 3V3 | D6 | GND | INT | MEAS | IGNR | 1V2 | 1V8 | HSYNC | PCLK | ICE40_CORE | D0 | IGNR | MEAS | CAM_ANA | D7 | Solder jumpers on the bottom determine / which components are included in current / measurement at top-left of board. / IGNR = don't measure; MEAS = do measure | 2V8 | D4 | 3V3 | IGNR | D2 | MCK | CFG_MEM | 1V2 | 1V8 | TRIG | GND | MEAS | VSYNC | IGNR | ICE_PLL | MEAS | IGNR | CAM_IO | MEAS | D3 | D1 | 3V3 | IGNR | MEAS | MIC2 | 3V3 | IGNR | 3V3 | 3V3 | 3V3 | 3V3 | IGNR | 3V3 | IGNR | MEAS | MEAS | QWIIC | MEAS | VCCIO1 | ICE_2V5 | MEM1_2 | OSC | MEAS | IGNR | MEM1_1